# Altium schematic sheet Main.SchDoc
size A; SheetNumber: 1; SheetTotal: 5
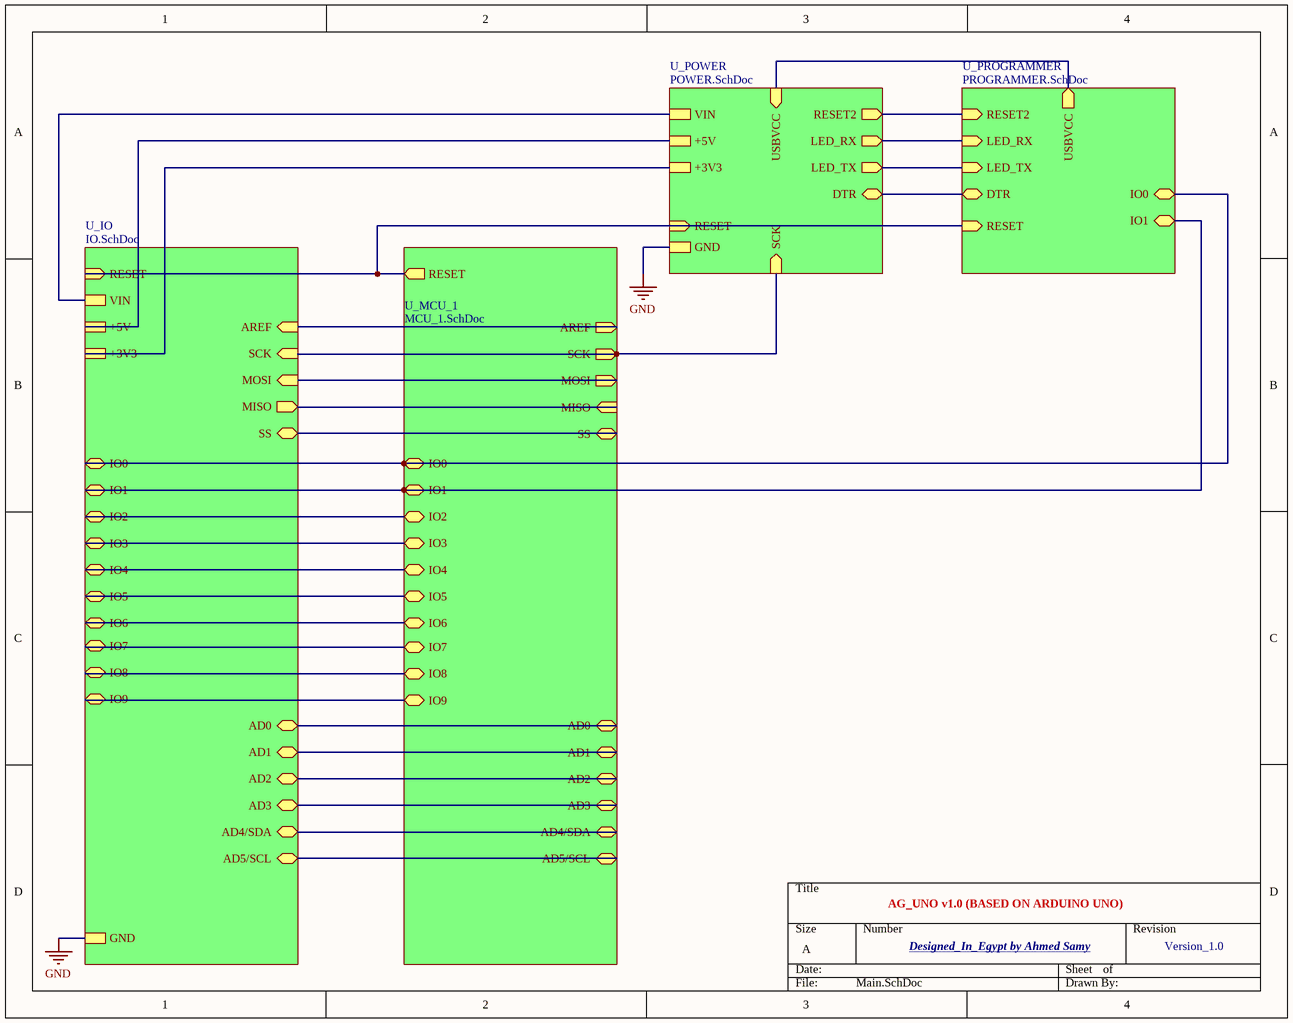
[diagram p0: Main.SchDoc]

## Sub-sheets
U_IO = IO.SchDoc: AD5/SCL (bidir), AD4/SDA (bidir), AREF (in), SCK (in), MISO (out), MOSI (in), SS (bidir), IO9 (bidir), IO8 (bidir), IO7 (bidir), IO6 (bidir), IO5 (bidir), IO4 (bidir), IO3 (bidir), IO2 (bidir), IO1 (bidir), IO0 (bidir), GND, +5V, +3V3, VIN, RESET (in), AD0 (bidir), AD2 (bidir), AD1 (bidir), AD3 (bidir)
U_MCU_1 = MCU_1.SchDoc: AREF (out), IO9 (bidir), IO8 (bidir), IO7 (bidir), IO6 (bidir), IO5 (bidir), IO4 (bidir), IO3 (bidir), IO2 (bidir), SCK (out), MISO (in), MOSI (out), SS (bidir), AD5/SCL (bidir), AD4/SDA (bidir), RESET (out), IO1 (bidir), IO0 (bidir), AD0 (bidir), AD2 (bidir), AD1 (bidir), AD3 (bidir)
U_POWER = POWER.SchDoc: VIN, USBVCC (in), LED_RX (out), LED_TX (out), DTR (bidir), RESET2 (out), GND, +5V, +3V3, SCK (in), RESET (in)
U_PROGRAMMER = PROGRAMMER.SchDoc: USBVCC (out), LED_RX (in), LED_TX (in), DTR (bidir), RESET2 (in), IO1 (bidir), IO0 (bidir), RESET (in)

## Nets
GND: sheet U_POWER/GND, sheet U_IO/GND
(unnamed): sheet U_POWER/VIN, sheet U_IO/VIN
(unnamed): sheet U_POWER/USBVCC, sheet U_PROGRAMMER/USBVCC
(unnamed): sheet U_POWER/LED_RX, sheet U_PROGRAMMER/LED_RX
(unnamed): sheet U_POWER/LED_TX, sheet U_PROGRAMMER/LED_TX
(unnamed): sheet U_POWER/DTR, sheet U_PROGRAMMER/DTR
(unnamed): sheet U_POWER/RESET2, sheet U_PROGRAMMER/RESET2
(unnamed): sheet U_POWER/+5V, sheet U_IO/+5V
(unnamed): sheet U_POWER/+3V3, sheet U_IO/+3V3
(unnamed): sheet U_POWER/SCK, sheet U_MCU_1/SCK, sheet U_IO/SCK
(unnamed): sheet U_POWER/RESET, sheet U_MCU_1/RESET, sheet U_IO/RESET, sheet U_PROGRAMMER/RESET
(unnamed): sheet U_MCU_1/AREF, sheet U_IO/AREF
(unnamed): sheet U_MCU_1/IO9, sheet U_IO/IO9
(unnamed): sheet U_MCU_1/IO8, sheet U_IO/IO8
(unnamed): sheet U_MCU_1/IO7, sheet U_IO/IO7
(unnamed): sheet U_MCU_1/IO6, sheet U_IO/IO6
(unnamed): sheet U_MCU_1/IO5, sheet U_IO/IO5
(unnamed): sheet U_MCU_1/IO4, sheet U_IO/IO4
(unnamed): sheet U_MCU_1/IO3, sheet U_IO/IO3
(unnamed): sheet U_MCU_1/IO2, sheet U_IO/IO2
(unnamed): sheet U_MCU_1/MISO, sheet U_IO/MISO
(unnamed): sheet U_MCU_1/MOSI, sheet U_IO/MOSI
(unnamed): sheet U_MCU_1/SS, sheet U_IO/SS
(unnamed): sheet U_MCU_1/AD5/SCL, sheet U_IO/AD5/SCL
(unnamed): sheet U_MCU_1/AD4/SDA, sheet U_IO/AD4/SDA
(unnamed): sheet U_MCU_1/IO1, sheet U_IO/IO1, sheet U_PROGRAMMER/IO1
(unnamed): sheet U_MCU_1/IO0, sheet U_IO/IO0, sheet U_PROGRAMMER/IO0
(unnamed): sheet U_MCU_1/AD0, sheet U_IO/AD0
(unnamed): sheet U_MCU_1/AD2, sheet U_IO/AD2
(unnamed): sheet U_MCU_1/AD1, sheet U_IO/AD1
(unnamed): sheet U_MCU_1/AD3, sheet U_IO/AD3

## Notes on the sheet
- AG_UNO v1.0 (BASED ON ARDUINO UNO)
- Designed_In_Egypt by Ahmed Samy
- Version_1.0